# EAGLE design Adaptor485 (EAGLE 6.5.0)
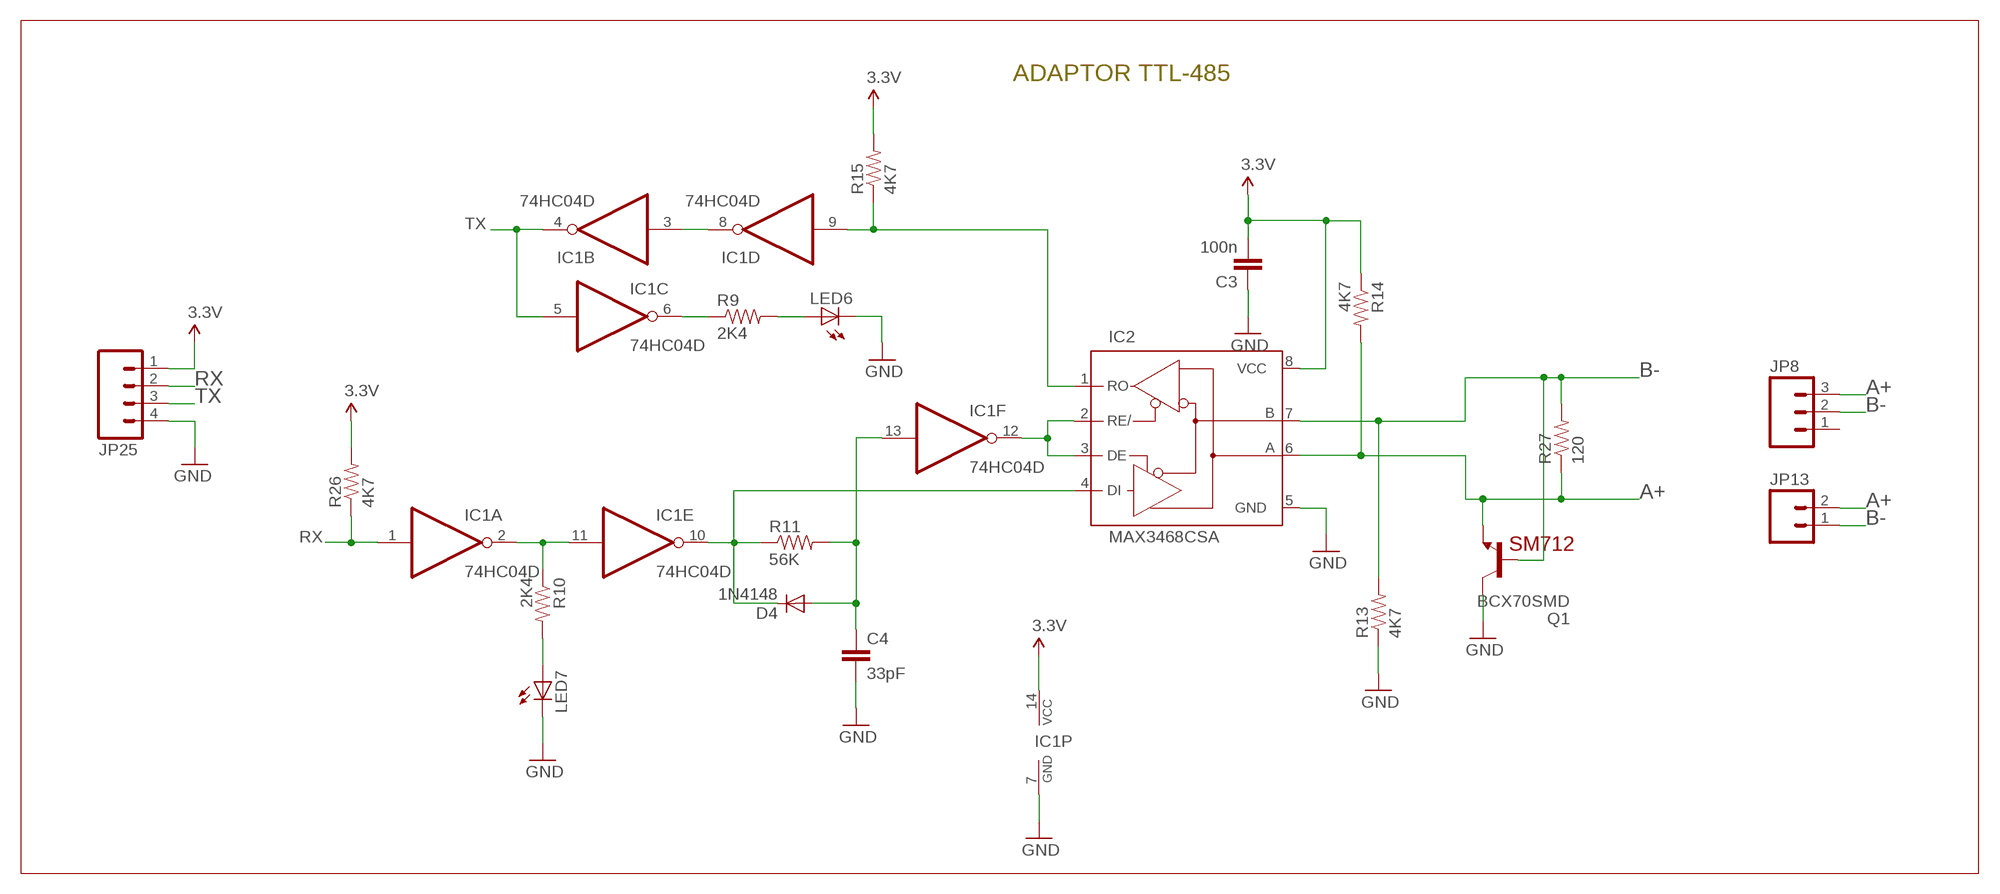
[diagram p0: schematic, sheet 1]

## Parts
C3  100n  CAP0805  [0805]
C4  33pF  CAP0805  [0805]
D4  1N4148  DIODE-MINIMELF  [MINIMELF]
IC1  74HC04D  [SO14]
IC2  MAX3468CSA  [SO08]
JP8  M03-SCREW-5MM  [SCREWTERMINAL-5MM-3]
JP13  M025MM  [SCREWTERMINAL-5MM-2]
JP25  M04PTH  [1X04]
LED6  LEDCHIP-LED0805  [CHIP-LED0805]
LED7  LEDCHIP-LED0805  [CHIP-LED0805]
Q1  BCX70SMD  [SOT23]
R9  2K4  RESISTOR0805-RES  [0805]
R10  2K4  RESISTOR0805-RES  [0805]
R11  56K  RESISTOR0805-RES  [0805]
R13  4K7  RESISTOR0805-RES  [0805]
R14  4K7  RESISTOR0805-RES  [0805]
R15  4K7  RESISTOR0805-RES  [0805]
R26  4K7  RESISTOR0805-RES  [0805]
R27  120  RESISTOR0805-RES  [0805]

## Nets
3.3V: C3.2 IC1.14(P:VCC) IC2.8(VCC) JP25.1 R14.1 R15.2 R26.2
A+: IC2.6(A) JP8.3 JP13.2 Q1.2(E) R14.2 R27.1
B-: IC2.7(B) JP8.2 JP13.1 Q1.1(B) R13.2 R27.2
GND: C3.1 C4.2 IC1.7(P:GND) IC2.5(GND) JP25.4 LED6.C LED7.C Q1.3(C) R13.1
N$16: LED7.A R10.2
N$17: LED6.A R9.2
N$19: IC1.2(A:O) IC1.11(E:I) R10.1
N$21: IC1.9(D:I) IC2.1(RO) R15.1
N$23: IC1.3(B:I) IC1.8(D:O)
N$24: C4.1 D4.A IC1.13(F:I) R11.2
N$27: IC1.6(C:O) R9.1
N$29: D4.C IC1.10(E:O) IC2.4(DI) R11.1
N$30: IC1.12(F:O) IC2.2(RE/) IC2.3(DE)
RX: IC1.1(A:I) JP25.2 R26.1
TX: IC1.4(B:O) IC1.5(C:I) JP25.3
Unconnected: JP8.1

## Notes on the sheet
- ADAPTOR TTL-485
- SM712

## Library data of the parts
C3 C4 = SparkFun-Passives:CAP: Capacitor Standard 0603 ceramic capacitor, and 0.1" leaded capacitor.
D4 = diode:DIODE-: DIODE
IC1 = 74xx-eu:74*04: Hex INVERTER
IC2 = maxim:MAX34*: +5V, Fail-Safe, 40Mbps, Profibus RS-485/RS-422 Transceivers Source: MAX3465-MAX3469.pdf; MPN: MAX3468CSA+; OC_FARNELL: unknown; OC_NEWARK: 76K6721
JP8 = SparkFun-Connectors:M03: Header 3 Standard 3-pin 0.1" header. Use with straight break away headers (SKU : PRT-00116), right angle break away headers (PRT-00553), swiss pins (PRT-00743), machine pins (PRT-00117), and female headers (PRT-00115). Molex polarized connector foot print use with SKU : PRT-08232 with associated crimp pins and housings.; STOREFRONT_ID: PRT-08433
JP13 = SparkFun-Connectors:M02: Header 2 Standard 2-pin 0.1" header. Use with straight break away headers (SKU : PRT-00116), right angle break away headers (PRT-00553), swiss pins (PRT-00743), machine pins (PRT-00117), and female headers (PRT-00115). Molex polarized connector foot print use with SKU : PRT-08233 with associated crimp pins and housings.
JP25 = SparkFun-Connectors:M04: Header 4 Standard 4-pin 0.1" header. Use with straight break away headers (SKU : PRT-00116), right angle break away headers (PRT-00553), swiss pins (PRT-00743), machine pins (PRT-00117), and female headers (PRT-00115). Molex polarized connector foot print use with SKU : PRT-08231 with associated crimp pins and housings. 1MM SMD Version SKU: PRT-10208
LED6 LED7 = led:LED: LED OSRAM: - CHIPLED LG R971, LG N971, LY N971, LG Q971, LY Q971, LO R971, LY R971 LH N974, LH R974 LS Q976, LO Q976, LY Q976 LO Q996 - Hyper CHIPLED LW Q18S LB Q993, LB Q99A, LB R99A - SideLED LS A670, LO A670, LY A670, LG A670, LP A670 LB A673, LV A673, LT A673, LW A673 LH A674 LY A675 LS A676, LA A676, LO A676, LY A676, LW A676 LS A679, LY A679, LG A679 - Hyper Micro SIDELED® LS Y876, LA Y876, LO Y876, LY Y876 LT Y87S - SmartLED LW L88C, LW L88S LB L89C, LB L89S, LG L890 LS L89K, LO L89K, LY L89K LS L896, LA L896, LO L896, LY L896 - TOPLED LS T670, LO T670, LY T670, LG T670, LP T670 LSG T670, LSP T670, LSY T670, LOP T670, LYG T670 LG T671, LOG T671, LSG T671 LB T673, LV T673, LT T673, LW T673 LH T674 LS T676, LA T676, LO T676, LY T676, LB T676, LH T676, LSB T676, LW T676 LB T67C, LV T67C, LT T67C, LS T67K, LO T67K, LY T67K, LW E67C LS E67B, LA E67B, LO E67B, LY E67B, LB E67C, LV E67C, LT E67C LW T67C LS T679, LY T679, LG T679 LS T770, LO T770, LY T770, LG T770, LP T770 LB T773, LV T773, LT T773, LW T773 LH T774 LS E675, LA E675, LY E675, LS T675 LS T776, LA T776, LO T776, LY T776, LB T776 LHGB T686 LT T68C, LB T68C - Hyper Mini TOPLED® LB M676 - Mini TOPLED Santana® LG M470 LS M47K, LO M47K, LY M47K Source: http://www.osram.convergy.de LUXEON: - LUMILED® LXK2-PW12-R00, LXK2-PW12-S00, LXK2-PW14-U00, LXK2-PW14-V00 LXK2-PM12-R00, LXK2-PM12-S00, LXK2-PM14-U00 LXK2-PE12-Q00, LXK2-PE12-R00, LXK2-PE12-S00, LXK2-PE14-T00, LXK2-PE14-U00 LXK2-PB12-K00, LXK2-PB12-L00, LXK2-PB12-M00, LXK2-PB14-N00, LXK2-PB14-P00, LXK2-PB14-Q00 LXK2-PR12-L00, LXK2-PR12-M00, LXK2-PR14-Q00, LXK2-PR14-R00 LXK2-PD12-Q00, LXK2-PD12-R00, LXK2-PD12-S00 LXK2-PH12-R00, LXK2-PH12-S00 LXK2-PL12-P00, LXK2-PL12-Q00, LXK2-PL12-R00 Source: www.luxeon.com KINGBRIGHT: KA-3528ASYC Source: www.kingbright.com
Q1 = transistor-npn:BCX70*: NPN Transistor
R9-R11 R13-R15 R26 R27 = SparkFun-Passives:RESISTOR: Resistor Basic schematic elements and footprints for 0603, 1206, and PTH resistors.

## Board
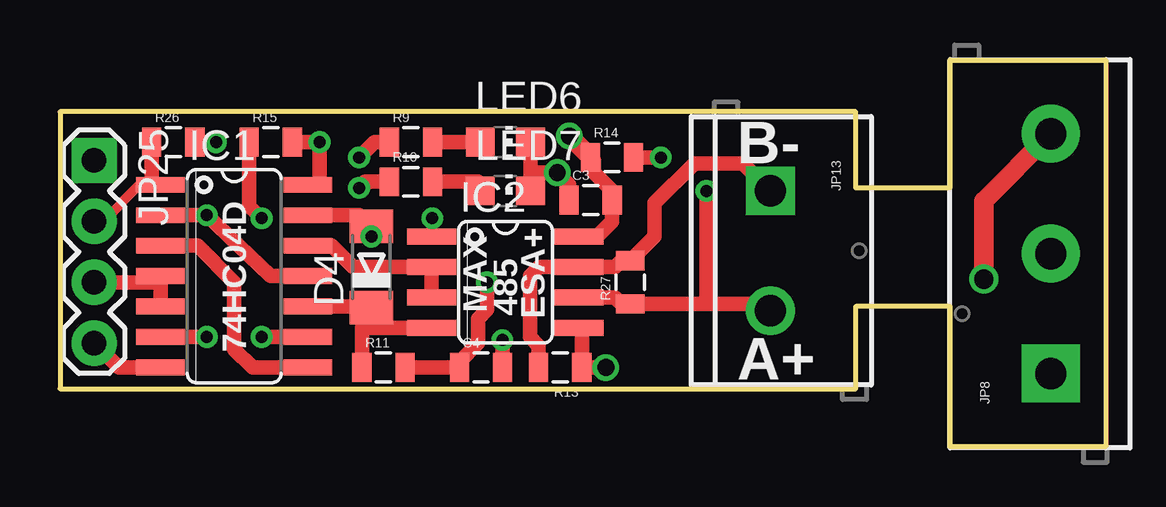
[diagram p1: board, top side]
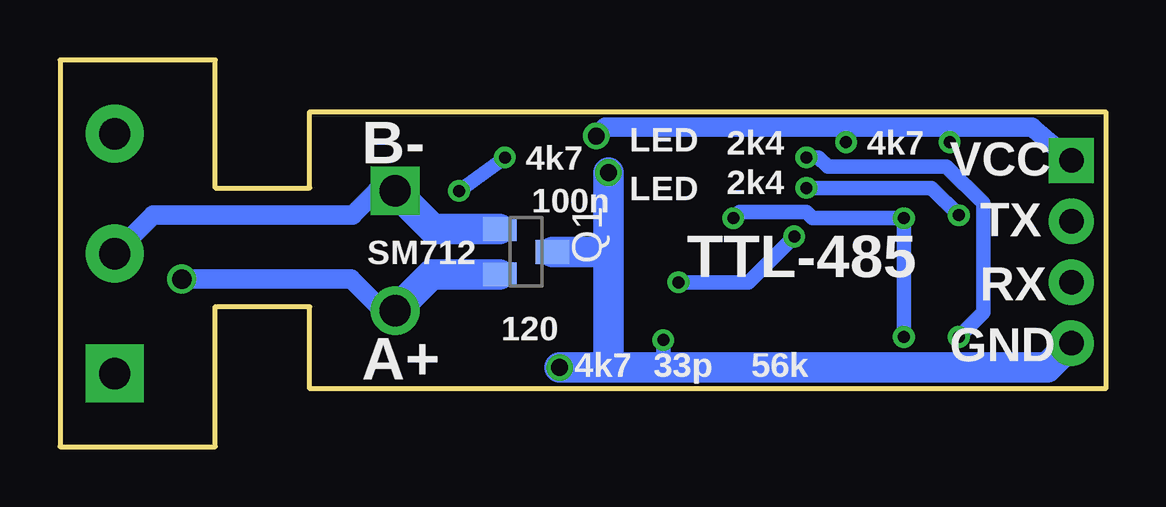
[diagram p2: board, bottom side, seen from below]

Size 43.59 x 16.13 mm. Coordinates in mm from the lower left corner, seen from the top.
Outline: 37.11,10.79 33.17,10.79 33.17,13.97 0,13.97 0,2.41 33.17,2.41 33.17,5.84 37.11,5.84 37.11,0 43.59,0 43.59,16.13 37.11,16.13 37.11,10.79
Copper layers (1*16): Top 0.035mm / dielectric 1.5mm / Bottom 0.035mm
Design rules "default *": minimum track width 10mil, minimum drill 24mil, track to track 8mil, track to pad 8mil, pad to pad 8mil, via to via 8mil, smd to smd 8mil, copper to edge 40mil, drill to drill 8mil, minimum pad ring 10mil, minimum via ring 8mil, stop-mask expansion 4mil, vias tented up to drill 24mil, thermal gap 10mil

### Footprints (pad centres in the part's own frame; a part is rotated, then mirrored left to right if it is on the bottom)
0805 = smd 0.8 x 1.2: 1 -0.9,0; 2 0.9,0
MINIMELF = smd 1.4 x 1.8: A 1.7,0; C -1.7,0
SO14 = smd 0.66 x 2.032: 1 -3.81,-3.073; 2 -2.54,-3.073; 3 -1.27,-3.073; 4 0,-3.073; 5 1.27,-3.073; 6 2.54,-3.073; 7 3.81,-3.073; 8 3.81,3.073; 9 2.54,3.073; 10 1.27,3.073; 11 0,3.073; 12 -1.27,3.073; 13 -2.54,3.073; 14 -3.81,3.073
SO08 = smd 0.66 x 2.032: 1 -1.905,-3.073; 2 -0.635,-3.073; 3 0.635,-3.073; 4 1.905,-3.073; 5 1.905,3.073; 6 0.635,3.073; 7 -0.635,3.073; 8 -1.905,3.073
SCREWTERMINAL-5MM-3 = drill 1.3 pad 2.413 square: 1 0,0 | drill 1.3 pad 2.413: 2 5,0; 3 10,0
SCREWTERMINAL-5MM-2 = drill 1.3 pad 2.032 square: 1 0,0 | drill 1.3 pad 2.032: 2 5,0
1X04 = drill 1.016 pad 1.88 square: 1 0,0 | drill 1.016 pad 1.88: 2 2.54,0; 3 5.08,0; 4 7.62,0
CHIP-LED0805 = smd 1.2 x 1.2: A 0,-1.05; C 0,1.05
SOT23 = smd 1 x 1.4: 1 -0.95,-1.1; 2 0.95,-1.1; 3 0,1.1

### Placement (x,y rotation side)
C3  22.12,10.29 0 top
C4  17.55,3.3 0 top
D4  12.98,7.49 90 top
IC1  7.26,7.11 270 top
IC2  18.57,6.86 270 top
JP8  41.3,3.05 90 top
JP13  29.62,10.67 270 top
JP25  1.42,11.94 270 top
LED6  18.57,12.7 270 top
LED7  18.57,10.67 270 top
Q1  24.16,8.13 270 bottom
R9  14.63,12.7 0 top
R10  14.63,11.05 0 top
R11  13.49,3.3 0 top
R13  20.85,3.3 180 top
R14  23.01,12.06 0 top
R15  8.79,12.7 0 top
R26  4.72,12.7 0 top
R27  23.77,6.86 90 top

### Tracks (layer width: path | path; a pad name or v marks a point on that pad's centre or on a via)
3.3V  (via drill 0.5, 0.7)
  Top 0.61: R15.2 v10.82,12.7 10.82,10.92 IC1.14 | R26.2 v6.5,12.7 | IC2.8 22.38,8.76 23.01,9.4 C3.2 23.02,10.66 22.25,11.43 22.25,11.93 R14.1 22.11,12.08
  Top 0.813: 22.11,12.08 v21.23,12.95
  Bottom 0.61: v10.82,12.7 10.82,13.33 | v6.5,12.7 6.5,13.33 6.63,13.33
  Bottom 0.813: v21.23,12.95 20.85,13.33 10.82,13.33 6.63,13.33 3.07,13.33 JP25.1
A+  (via drill 0.5, 0.8)
  Top 0.61: IC2.6 23.14,6.22 23.4,5.96 R27.1 26.95,5.96 | 26.95,5.96 29.33,5.96 JP13.2 | R14.2 v25.04,12.06 | v26.95,10.67 26.95,5.96
  Top 0.813: v38.51,6.99 38.51,10.25 JP8.3
  Bottom 0.61: v25.04,12.06 v26.95,10.67
  Bottom 0.813: v38.51,6.99 31.44,6.99 30.12,5.67 JP13.2
  Bottom 1.27: Q1.2 28.11,7.18 JP13.2
B-
  Top 0.61: R13.2 19.95,4.2 19.58,4.57 19.58,7.11 19.96,7.49 IC2.7 23.14,7.49 23.4,7.76 R27.2 24.79,8.77 24.79,10.16 26.44,11.81 28.47,11.81 JP13.1
  Bottom 0.813: JP13.1 30.38,10.67 31.39,9.65 39.7,9.65 JP8.2
  Bottom 1.27: Q1.1 28.03,9.08 JP13.1
GND  (via drill 0.5, 0.7)
  Top 0.61: C3.1 21.22,10.93 v20.73,11.43 19.62,11.43 | LED7.C 19.62,11.43 | 19.62,11.43 LED6.C | JP25.4 2.44,3.3 IC1.7 | IC2.5 21.75,4.95 R13.1 v22.76,3.3 | C4.2 v18.44,4.45
  Bottom 0.61: v18.44,4.45 C4.2 19.2,3.3
  Bottom 1.27: JP25.4 2.44,3.3 19.2,3.3 20.73,3.3 | 20.73,3.3 v22.76,3.3 | v20.73,11.43 20.73,8.13 | 20.73,8.13 20.73,3.3 | Q1.3 20.73,8.13
N$16
  Top 0.406: 17.44,11.05 LED7.A
  Top 0.61: R10.2 17.44,11.05
N$17
  Top 0.61: R9.2 LED6.A
N$19  (via drill 0.5)
  Top 0.61: IC1.2 v6.12,9.65 8.79,7.11 IC1.11 | R10.1 12.73,11.05 v12.47,10.79
  Bottom 0.61: v6.12,9.65 7.26,10.79 v12.47,10.79
N$21  (via drill 0.5)
  Top 0.406: IC2.1 15.52,8.79 v15.52,9.52
  Top 0.61: IC1.9 v8.41,4.57 | v8.41,9.52 7.89,10.02 R15.1
  Bottom 0.61: v8.41,4.57 v8.41,9.52 12.22,9.52 12.47,9.78 15.27,9.78 v15.52,9.52
N$23
  Top 0.61: IC1.3 5.74,8.38 7.26,6.86 7.26,4.06 8.03,3.3 IC1.8
N$24  (via drill 0.5)
  Top 0.406: D4.A 12.9,8.89 v12.98,8.76 | C4.1 16.65,3.54
  Top 0.61: IC1.13 12.47,9.65 D4.A | R11.2 C4.1 | 16.65,3.54 17.42,4.32 17.42,5.33 17.81,5.71 v17.81,6.86
  Bottom 0.61: v12.98,8.76 14.88,6.86 v17.81,6.86
N$27  (via drill 0.5)
  Top 0.61: v6.12,4.57 IC1.6 | R9.1 13.11,12.7 v12.47,12.06
  Bottom 0.61: v12.47,12.06 11.96,12.06 11.58,11.68 6.63,11.68 5.11,10.16 5.11,5.59 v6.12,4.57
N$29
  Top 0.406: 12.14,5.84 D4.C 12.59,5.92 12.59,4.95
  Top 0.61: IC1.10 12.14,5.84 | R11.1 12.59,4.95 IC2.4
N$30
  Top 0.406: IC1.12 11.33,8.38
  Top 0.61: IC2.3 IC2.2 12.22,7.49 11.33,8.38
RX
  Top 0.406: 3.82,10.92 IC1.1 3.33,10.92 1.8,9.4
  Top 0.61: R26.1 3.82,10.92 | JP25.2 1.8,9.4
TX
  Top 0.406: 4.19,6.86 IC1.4
  Top 0.61: IC1.5 IC1.4 | JP25.3 4.19,6.86

### Text on the board
tPlace: B- | MAX | 485 | ESA+ | 74HC04D | A+
bPlace: 4k7 | 2k4 | LED | 4k7 | B- | VCC | 2k4 | LED | 100n | TX | TTL-485 | SM712 | RX | 120 | GND | 56k | 33p | 4k7 | A+